# EAGLE design I2C To ADC Adapter (EAGLE 6.4)
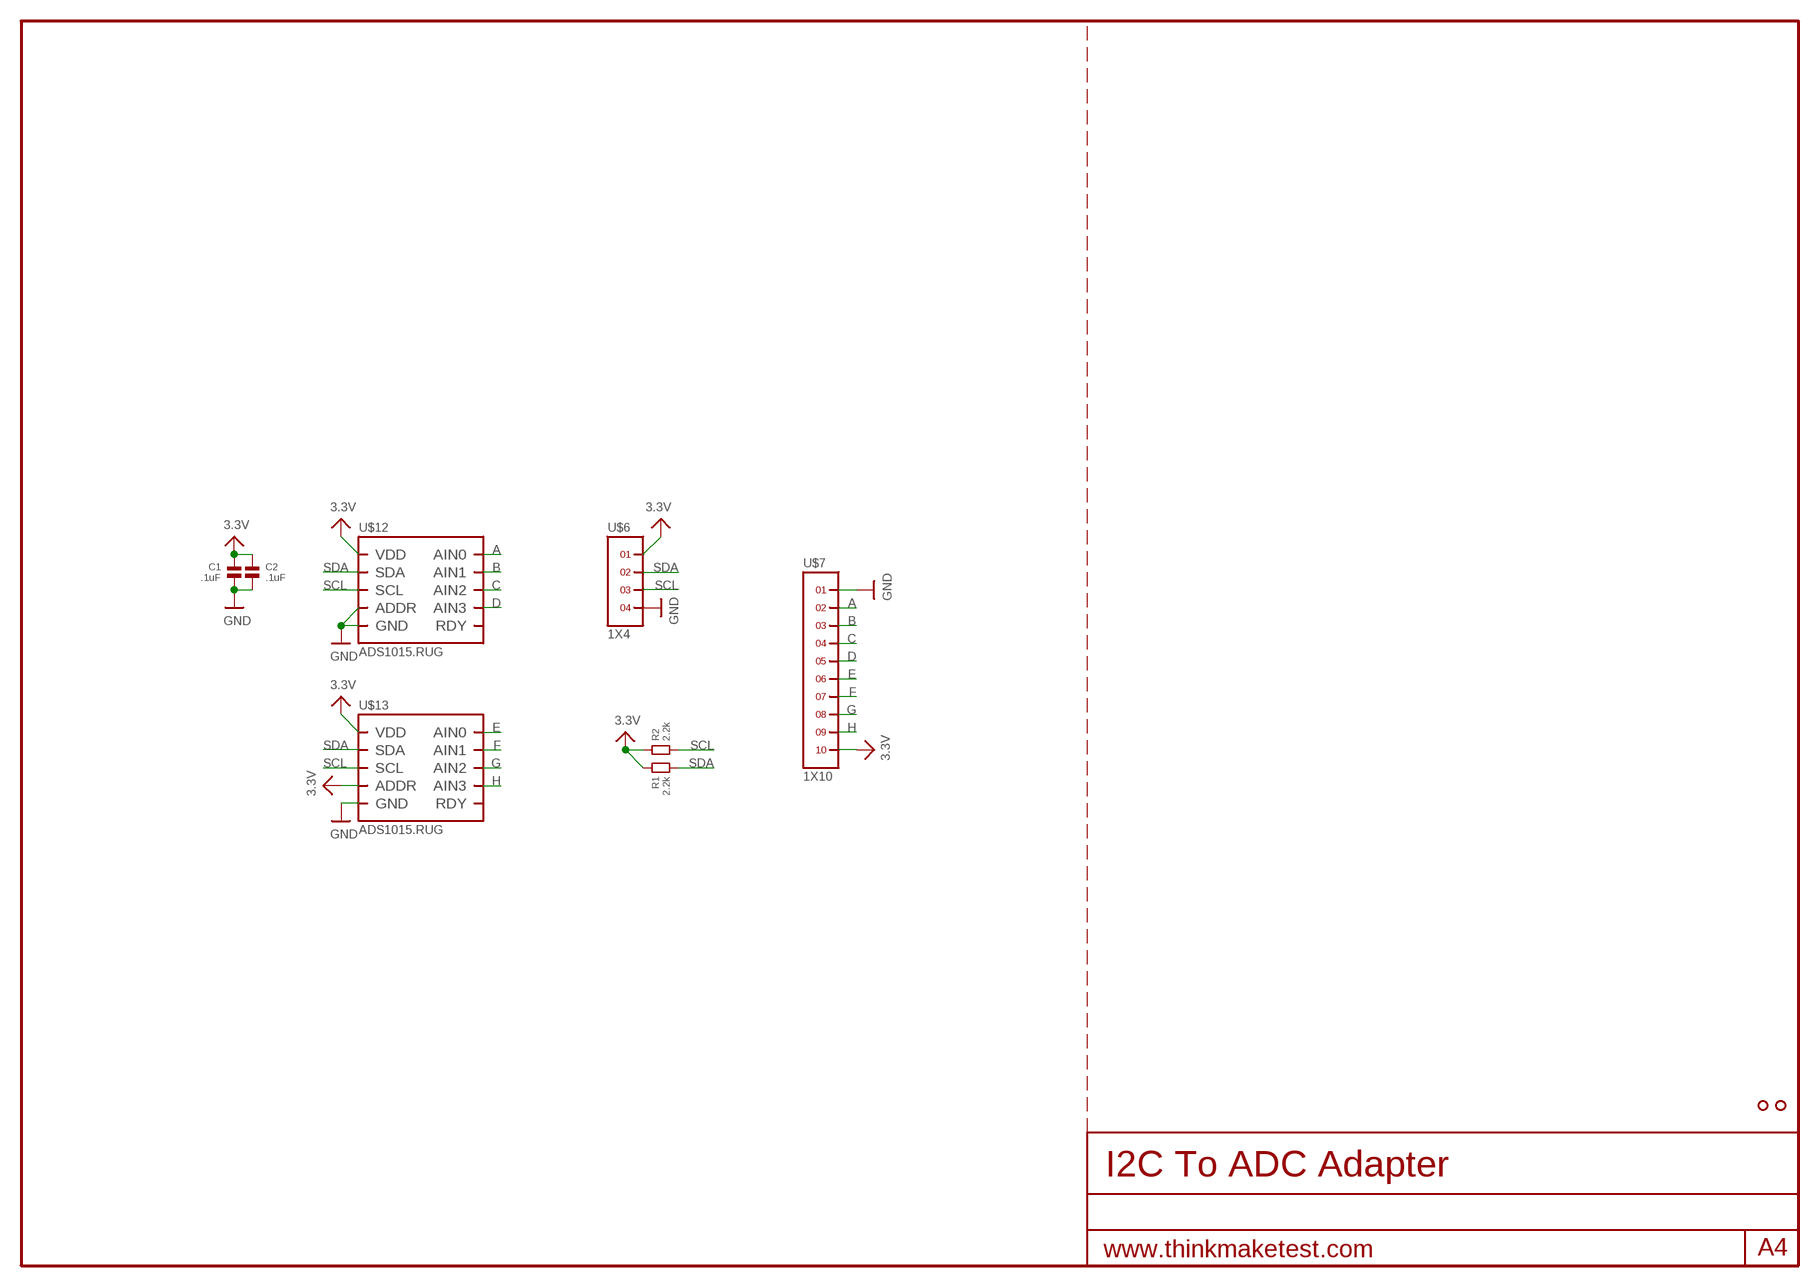
[diagram p0: schematic, sheet 1]

## Parts
C1  .1uF  CAPACITOR.0603  [0603]
C2  .1uF  CAPACITOR.0603  [0603]
R1  2.2k  RESISTOR.0603  [0603]
R2  2.2k  RESISTOR.0603  [0603]
U$3  HOLE.4MM  [4MM]
U$6  1X4  [1X4]
U$7  1X10  [1X10]
U$12  ADS1015.RUG  [RUG.10]
U$13  ADS1015.RUG  [RUG.10]
U$18  HOLE.4MM  [4MM]

## Nets
3.3V: C1.1 C2.1 R1.1 R2.1 U$6.1 U$7.10 U$12.8(VDD) U$13.1(ADDR) U$13.8(VDD)
A: U$7.2 U$12.4(AIN0)
B: U$7.3 U$12.5(AIN1)
C: U$7.4 U$12.6(AIN2)
D: U$7.5 U$12.7(AIN3)
E: U$7.6 U$13.4(AIN0)
F: U$7.7 U$13.5(AIN1)
G: U$7.8 U$13.6(AIN2)
GND: C1.2 C2.2 U$6.4 U$7.1 U$12.1(ADDR) U$12.3(GND) U$13.3(GND)
H: U$7.9 U$13.7(AIN3)
SCL: R2.2 U$6.3 U$12.10(SCL) U$13.10(SCL)
SDA: R1.2 U$6.2 U$12.9(SDA) U$13.9(SDA)
Unconnected: U$12.2(RDY) U$13.2(RDY)

## Library data of the parts
C1 C2 = standardparts:CAPACITOR
R1 R2 = standardparts:RESISTOR
U$3 U$18 = screw_holes:HOLE
U$6 = headers(.1in):1X4
U$7 = headers(.1in):1X10
U$12 U$13 = packages(ti):ADS1015

## Board
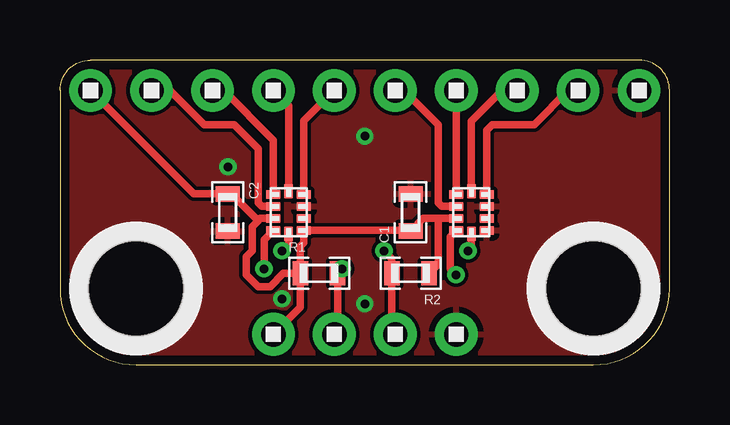
[diagram p1: board, top side]
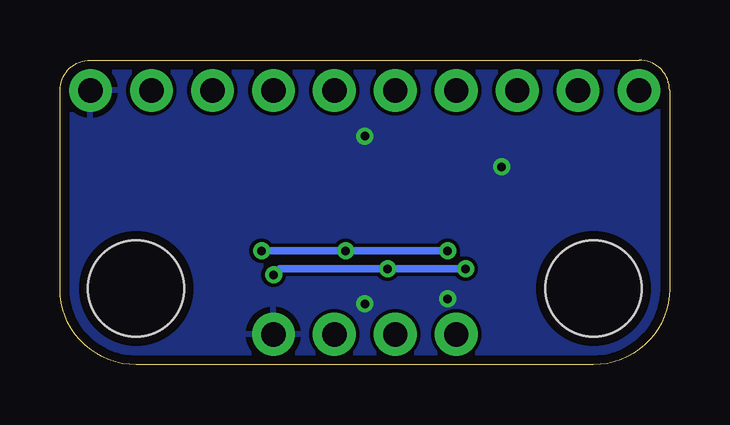
[diagram p2: board, bottom side, seen from below]

Size 25.4 x 12.7 mm. Coordinates in mm from the lower left corner, seen from the top.
Outline: 0,11.43 0,3.17 arc90 3.17,0 22.23,0 arc90 25.4,3.17 25.4,11.43 arc90 24.13,12.7 1.27,12.7 arc90 0,11.43
Copper layers (1*16): Top 0.0356mm / dielectric 1.5011mm / Bottom 0.0356mm
Design rules "OSHPark": minimum track width 6mil, minimum drill 13mil, track to track 6mil, track to pad 6mil, pad to pad 6mil, via to via 6mil, smd to smd 6mil, copper to edge 15mil, drill to drill 6mil, minimum pad ring 7mil, minimum via ring 7mil, stop-mask expansion 4mil, vias tented up to drill 16mil, thermal gap 10mil

### Footprints (pad centres in the part's own frame; a part is rotated, then mirrored left to right if it is on the bottom)
0603 = smd 0.65 x 1: 1 -0.775,0; 2 0.775,0
4MM = hole 4: 0,0
1X4 = drill 1.016 pad 1.778: 1 0,0; 2 2.54,0; 3 5.08,0; 4 7.62,0
1X10 = drill 1.016 pad 1.778: 1 0,0; 2 2.54,0; 3 5.08,0; 4 7.62,0; 5 10.16,0; 6 12.7,0; 7 15.24,0; 8 17.78,0; 9 20.32,0; 10 22.86,0
RUG.10 = smd 0.58 x 0.35: 1 -0.635,0.75; 2 -0.635,0.25; 3 -0.635,-0.25; 4 -0.635,-0.75; 6 0.635,-0.75; 7 0.635,-0.25; 8 0.635,0.25; 9 0.635,0.75 | smd 0.35 x 0.58: 5 0,-0.885; 10 0,0.885

### Placement (x,y rotation side)
C1  14.61,6.35 90 top
C2  6.99,6.35 270 top
R1  10.79,3.81 0 top
R2  14.61,3.81 180 top
U$3  3.17,3.17 0 top
U$6  8.89,1.27 0 top
U$7  24.13,11.43 180 top
U$12  17.14,6.35 180 top
U$13  9.53,6.35 180 top
U$18  22.23,3.17 0 top

### Tracks (layer width: path | path; a pad name or v marks a point on that pad's centre or on a via)
3.3V
  Top 0.305: U$12.8 15.75,6.1 | 15.75,6.1 15.13,6.1 C1.1 14.58,5.6 U$13.1 10.16,5.08 10.02,4.94 R1.1 | U$6.1 10.02,2.4 R1.1 | R2.1 15.75,4.18 15.75,6.1 | R1.1 9.31,3.81 8.75,3.25 8.25,3.25 7.75,3.75 7.75,4.5 8,4.75 8,5.75 8.25,6 | U$13.8 8.35,6.1 8.25,6 | 8.25,6 7.12,7.12 C2.1 5.58,7.12 U$7.10
A
  Top 0.305: U$12.4 17.78,9.78 18,10 19.75,10 21.18,11.43 U$7.2
B
  Top 0.305: U$12.5 17.14,10.14 18.43,11.43 U$7.3
C
  Top 0.305: U$12.6 U$7.4
D
  Top 0.305: U$12.7 15.9,6.6 15.75,6.75 15.75,10 14.32,11.43 U$7.5
E
  Top 0.305: U$13.4 10.16,10.16 U$7.6
F
  Top 0.305: U$13.5 9.53,10.79 U$7.7
G
  Top 0.305: U$13.6 8.89,9.36 6.82,11.43 U$7.8
GND  (via drill 0.36)
  other vias: 12.7,9.53 12.7,2.54 7,8.25 9.25,2.75
  pour Top (rank 6): 0,12.7 25.4,12.7 25.4,0 0,0
  pour Bottom: 0,12.7 25.4,12.7 25.4,0 0,0
H
  Top 0.305: U$13.7 8.4,6.6 8.25,6.75 8.25,9 7.25,10 6,10 4.57,11.43 U$7.9
SCL  (via drill 0.36)
  Top 0.305: U$6.3 13.83,1.41 R2.2 13.83,4.42 v13.5,4.75 | v17,4.75 17.14,4.89 U$12.10 | v9.25,4.75 9.53,5.03 U$13.10
  Bottom 0.305: v17,4.75 v13.5,4.75 13,4.75 v9.25,4.75
SDA  (via drill 0.36)
  Top 0.305: U$6.2 11.57,1.41 R1.2 v11.75,3.99 v11.75,4 | U$13.9 8.5,5.21 v8.5,4 | U$12.9 16.25,5.34 16.25,4 v16.5,3.75
  Bottom 0.305: v8.5,4 v11.75,4 16.25,4 v16.5,3.75

### Text on the board
tDocu: I2C To ADC Adapter
bDocu: 3.3v | 0 | 1 | 2 | 3 | 4 | 5 | 6 | 7 | GND | Cruz Monrreal II | AnomalousMaker.com | SDA | SCL | 3.3v | GND